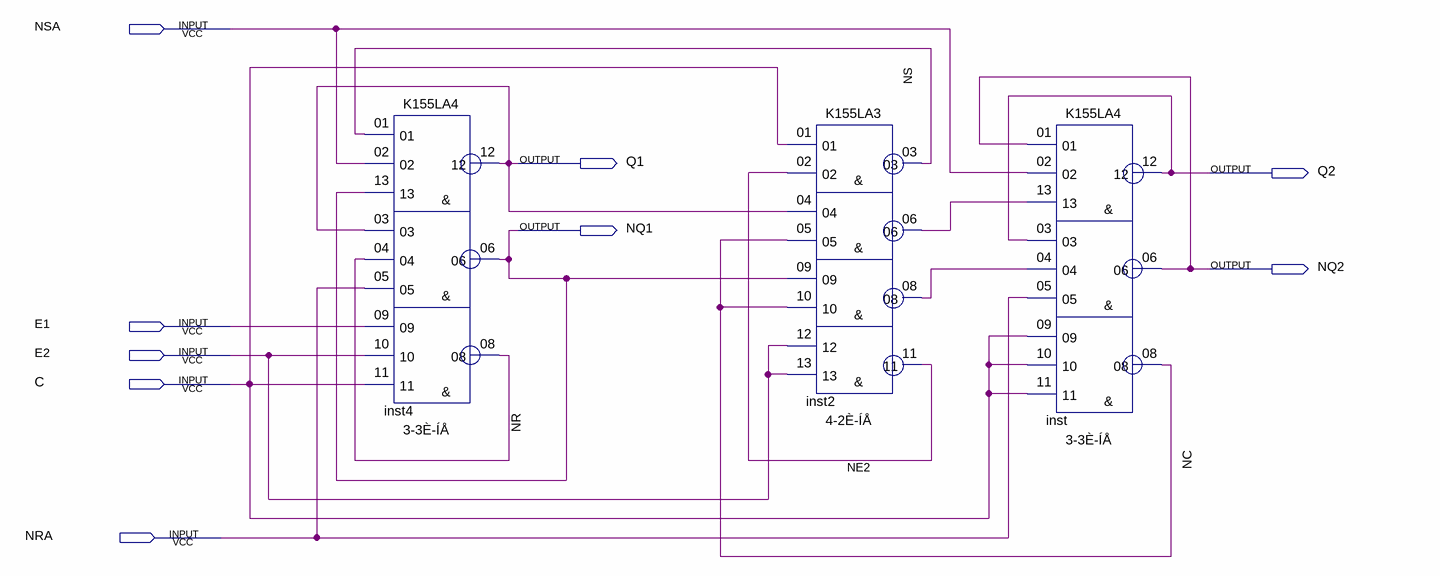
[diagram p0: schematic sheet]
// Quartus schematic scheme.bdf as structural Verilog: 3 symbols, 9 pins
module scheme (
  input  NSA,
  input  E1,
  input  E2,
  input  C,
  input  NRA,
  output Q1,
  output Q2,
  output NQ1,
  output NQ2
);

  wire inst2_06, inst2_08, NC, NE2, NR, NS;

  K155LA4 inst4 (
    .\01 (NS), .\02 (NSA), .\13 (NQ1), .\03 (Q1), .\04 (NR), .\05 (NRA), .\09 (E1), .\10 (E2), .\11 (C),
    .\12 (Q1), .\06 (NQ1), .\08 (NR));
  K155LA3 inst2 (
    .\01 (C), .\02 (NE2), .\04 (Q1), .\05 (NC), .\09 (NQ1), .\10 (NC), .\12 (E2), .\13 (E2), .\03 (NS),
    .\06 (inst2_06), .\08 (inst2_08), .\11 (NE2));
  K155LA4 inst (
    .\01 (NQ2), .\02 (NSA), .\13 (inst2_06), .\03 (Q2), .\04 (inst2_08), .\05 (NRA), .\09 (C), .\10 (C),
    .\11 (C), .\12 (Q2), .\06 (NQ2), .\08 (NC));
endmodule
